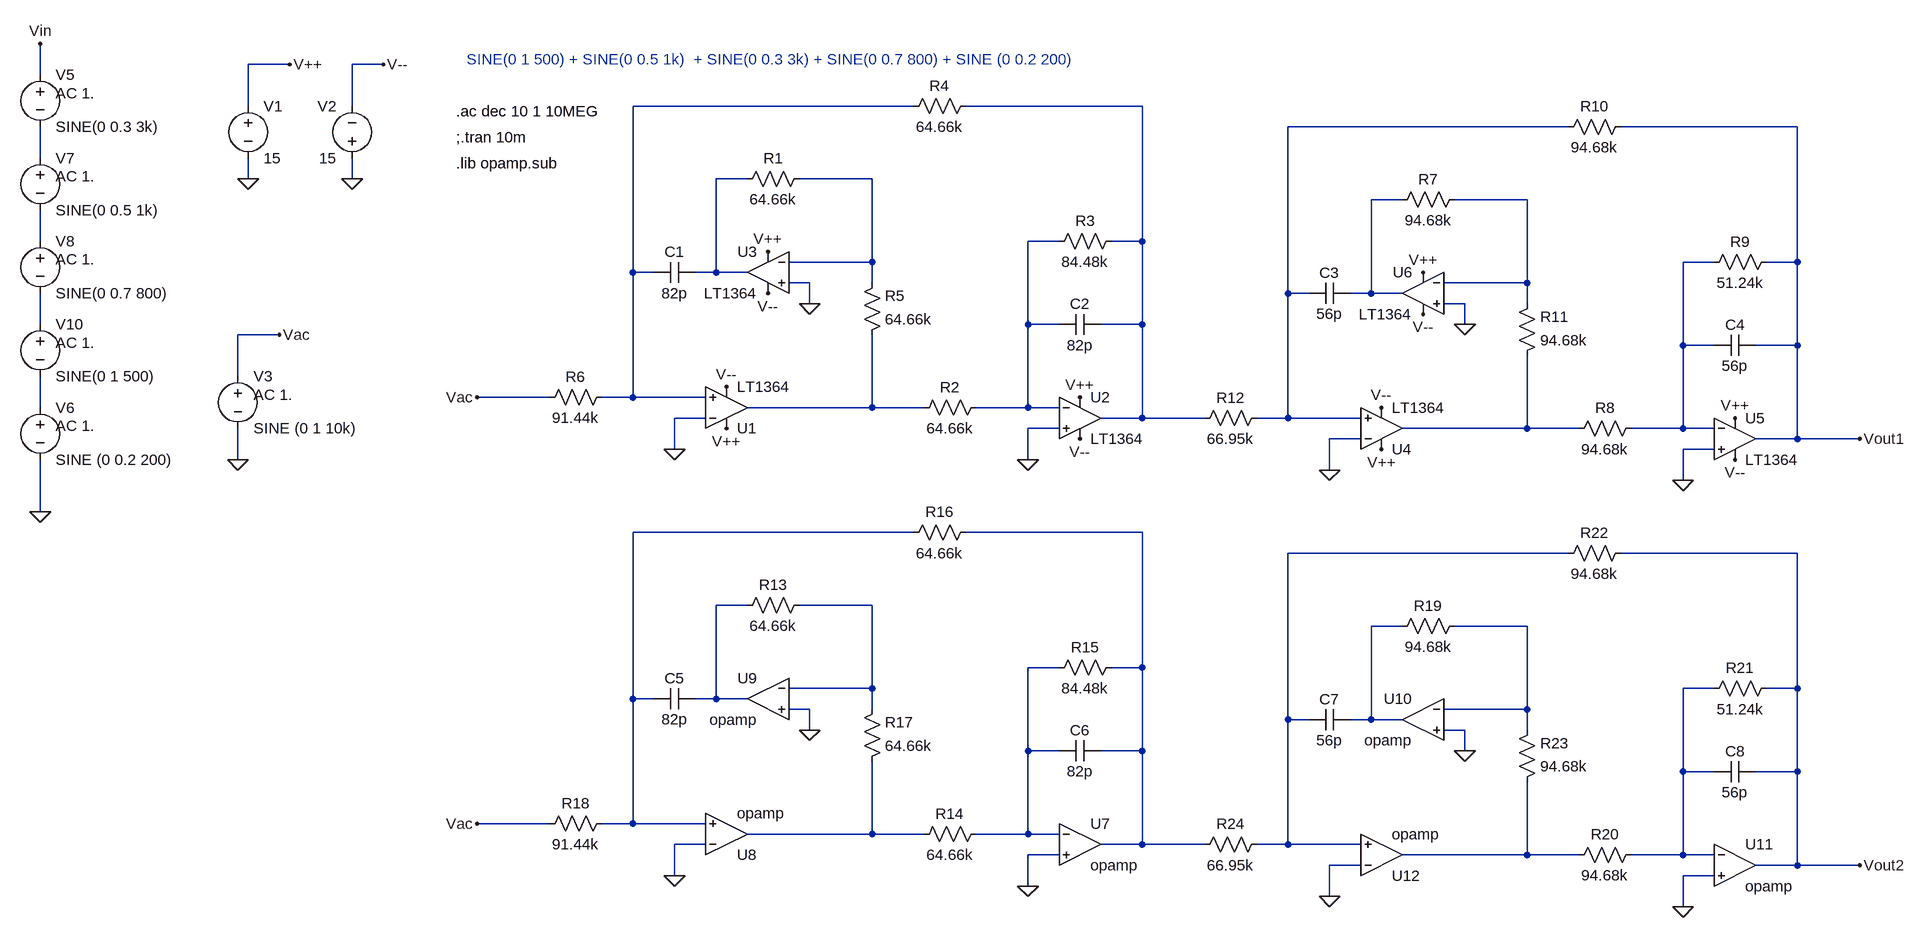
[diagram p0: schematic LT1364_Butterworth_AM.asc]
LT1364_Butterworth_AM.asc, the LTspice schematic file:
Version 4
SHEET 1 2556 680
WIRE -720 -800 -784 -800
WIRE -576 -800 -624 -800
WIRE -1104 -784 -1104 -832
WIRE -784 -736 -784 -800
WIRE -624 -736 -624 -800
WIRE 240 -736 -192 -736
WIRE 592 -736 320 -736
WIRE 1248 -704 816 -704
WIRE 1600 -704 1328 -704
WIRE -1104 -656 -1104 -704
WIRE -784 -624 -784 -656
WIRE -624 -624 -624 -656
WIRE -16 -624 -64 -624
WIRE 176 -624 64 -624
WIRE 992 -592 944 -592
WIRE 1184 -592 1072 -592
WIRE -1104 -528 -1104 -576
WIRE 464 -528 416 -528
WIRE 592 -528 592 -736
WIRE 592 -528 544 -528
WIRE 176 -496 176 -624
WIRE 176 -496 48 -496
WIRE 1472 -496 1424 -496
WIRE 1600 -496 1600 -704
WIRE 1600 -496 1552 -496
WIRE -192 -480 -192 -736
WIRE -160 -480 -192 -480
WIRE -64 -480 -64 -624
WIRE -64 -480 -96 -480
WIRE -16 -480 -64 -480
WIRE 80 -464 48 -464
WIRE 176 -464 176 -496
WIRE 1184 -464 1184 -592
WIRE 1184 -464 1056 -464
WIRE 816 -448 816 -704
WIRE 848 -448 816 -448
WIRE 944 -448 944 -592
WIRE 944 -448 912 -448
WIRE 992 -448 944 -448
WIRE 80 -432 80 -464
WIRE 1088 -432 1056 -432
WIRE 1184 -432 1184 -464
WIRE -1104 -400 -1104 -448
WIRE 416 -400 416 -528
WIRE 464 -400 416 -400
WIRE 592 -400 592 -528
WIRE 592 -400 528 -400
WIRE 1088 -400 1088 -432
WIRE -736 -384 -800 -384
WIRE 1424 -368 1424 -496
WIRE 1472 -368 1424 -368
WIRE 1600 -368 1600 -496
WIRE 1600 -368 1536 -368
WIRE -800 -320 -800 -384
WIRE -320 -288 -432 -288
WIRE -192 -288 -192 -480
WIRE -192 -288 -240 -288
WIRE -80 -288 -192 -288
WIRE -1104 -272 -1104 -320
WIRE 176 -272 176 -384
WIRE 176 -272 -16 -272
WIRE 256 -272 176 -272
WIRE 416 -272 416 -400
WIRE 416 -272 336 -272
WIRE 464 -272 416 -272
WIRE -80 -256 -128 -256
WIRE 592 -256 592 -400
WIRE 592 -256 528 -256
WIRE 688 -256 592 -256
WIRE 816 -256 816 -448
WIRE 816 -256 768 -256
WIRE 928 -256 816 -256
WIRE 464 -240 416 -240
WIRE 1184 -240 1184 -352
WIRE 1184 -240 992 -240
WIRE 1264 -240 1184 -240
WIRE 1424 -240 1424 -368
WIRE 1424 -240 1344 -240
WIRE 1472 -240 1424 -240
WIRE 928 -224 880 -224
WIRE 1600 -224 1600 -368
WIRE 1600 -224 1536 -224
WIRE 1696 -224 1600 -224
WIRE -128 -208 -128 -256
WIRE 1472 -208 1424 -208
WIRE -800 -192 -800 -240
WIRE 416 -192 416 -240
WIRE 880 -176 880 -224
WIRE 1424 -160 1424 -208
WIRE -1104 -112 -1104 -192
WIRE 240 -80 -192 -80
WIRE 592 -80 320 -80
WIRE 1248 -48 816 -48
WIRE 1600 -48 1328 -48
WIRE -16 32 -64 32
WIRE 176 32 64 32
WIRE 992 64 944 64
WIRE 1184 64 1072 64
WIRE 464 128 416 128
WIRE 592 128 592 -80
WIRE 592 128 544 128
WIRE 176 160 176 32
WIRE 176 160 48 160
WIRE 1472 160 1424 160
WIRE 1600 160 1600 -48
WIRE 1600 160 1552 160
WIRE -192 176 -192 -80
WIRE -160 176 -192 176
WIRE -64 176 -64 32
WIRE -64 176 -96 176
WIRE -16 176 -64 176
WIRE 80 192 48 192
WIRE 176 192 176 160
WIRE 1184 192 1184 64
WIRE 1184 192 1056 192
WIRE 816 208 816 -48
WIRE 848 208 816 208
WIRE 944 208 944 64
WIRE 944 208 912 208
WIRE 992 208 944 208
WIRE 80 224 80 192
WIRE 1088 224 1056 224
WIRE 1184 224 1184 192
WIRE 416 256 416 128
WIRE 464 256 416 256
WIRE 592 256 592 128
WIRE 592 256 528 256
WIRE 1088 256 1088 224
WIRE 1424 288 1424 160
WIRE 1472 288 1424 288
WIRE 1600 288 1600 160
WIRE 1600 288 1536 288
WIRE -320 368 -432 368
WIRE -192 368 -192 176
WIRE -192 368 -240 368
WIRE -80 368 -192 368
WIRE 176 384 176 272
WIRE 176 384 -16 384
WIRE 256 384 176 384
WIRE 416 384 416 256
WIRE 416 384 336 384
WIRE 464 384 416 384
WIRE -80 400 -128 400
WIRE 592 400 592 256
WIRE 592 400 528 400
WIRE 688 400 592 400
WIRE 816 400 816 208
WIRE 816 400 768 400
WIRE 928 400 816 400
WIRE 464 416 416 416
WIRE 1184 416 1184 304
WIRE 1184 416 992 416
WIRE 1264 416 1184 416
WIRE 1424 416 1424 288
WIRE 1424 416 1344 416
WIRE 1472 416 1424 416
WIRE 928 432 880 432
WIRE 1600 432 1600 288
WIRE 1600 432 1536 432
WIRE 1696 432 1600 432
WIRE -128 448 -128 400
WIRE 1472 448 1424 448
WIRE 416 464 416 416
WIRE 880 480 880 432
WIRE 1424 496 1424 448
FLAG -784 -624 0
FLAG -624 -624 0
FLAG -720 -800 V++
FLAG -576 -800 V--
FLAG -48 -304 V--
FLAG -48 -240 V++
FLAG -800 -192 0
FLAG 496 -224 V--
FLAG 496 -288 V++
FLAG 16 -448 V--
FLAG 16 -512 V++
FLAG -1104 -832 Vin
FLAG -736 -384 Vac
FLAG -1104 -112 0
FLAG 80 -432 0
FLAG -128 -208 0
FLAG 416 -192 0
FLAG 960 -272 V--
FLAG 960 -208 V++
FLAG 1504 -192 V--
FLAG 1504 -256 V++
FLAG 1024 -416 V--
FLAG 1024 -480 V++
FLAG 1088 -400 0
FLAG 880 -176 0
FLAG 1424 -160 0
FLAG 1696 -224 Vout1
FLAG -432 -288 Vac
FLAG 80 224 0
FLAG -128 448 0
FLAG 416 464 0
FLAG 1088 256 0
FLAG 880 480 0
FLAG 1424 496 0
FLAG 1696 432 Vout2
FLAG -432 368 Vac
SYMBOL Opamps\\LT1364 -48 -208 M180
SYMATTR InstName U1
SYMBOL voltage -784 -752 R0
WINDOW 123 0 0 Left 0
WINDOW 39 0 0 Left 0
SYMATTR InstName V1
SYMATTR Value 15
SYMBOL voltage -624 -640 R180
WINDOW 0 24 96 Left 2
WINDOW 3 24 16 Left 2
SYMATTR InstName V2
SYMATTR Value 15
SYMBOL voltage -800 -336 R0
WINDOW 123 24 44 Left 2
WINDOW 39 0 0 Left 0
SYMATTR Value2 AC 1.
SYMATTR InstName V3
SYMATTR Value SINE (0 1 10k)
SYMBOL Opamps\\LT1364 496 -320 R0
SYMATTR InstName U2
SYMBOL Opamps\\LT1364 16 -544 M0
SYMATTR InstName U3
SYMBOL voltage -1104 -800 R0
WINDOW 123 24 44 Left 2
WINDOW 39 0 0 Left 0
SYMATTR Value2 AC 1.
SYMATTR InstName V5
SYMATTR Value SINE(0 0.3 3k)
SYMBOL voltage -1104 -288 R0
WINDOW 123 24 44 Left 2
WINDOW 39 0 0 Left 0
SYMATTR Value2 AC 1.
SYMATTR InstName V6
SYMATTR Value SINE (0 0.2 200)
SYMBOL voltage -1104 -672 R0
WINDOW 123 24 44 Left 2
WINDOW 39 0 0 Left 0
SYMATTR Value2 AC 1.
SYMATTR InstName V7
SYMATTR Value SINE(0 0.5 1k)
SYMBOL voltage -1104 -544 R0
WINDOW 123 24 44 Left 2
WINDOW 39 0 0 Left 0
SYMATTR Value2 AC 1.
SYMATTR InstName V8
SYMATTR Value SINE(0 0.7 800)
SYMBOL voltage -1104 -416 R0
WINDOW 123 24 44 Left 2
WINDOW 39 0 0 Left 0
SYMATTR Value2 AC 1.
SYMATTR InstName V10
SYMATTR Value SINE(0 1 500)
SYMBOL res 80 -640 R90
WINDOW 0 0 56 VBottom 2
WINDOW 3 32 56 VTop 2
SYMATTR InstName R1
SYMATTR Value 64.66k
SYMBOL res 352 -288 R90
WINDOW 0 0 56 VBottom 2
WINDOW 3 32 56 VTop 2
SYMATTR InstName R2
SYMATTR Value 64.66k
SYMBOL res 560 -544 R90
WINDOW 0 0 56 VBottom 2
WINDOW 3 32 56 VTop 2
SYMATTR InstName R3
SYMATTR Value 84.48k
SYMBOL res 336 -752 R90
WINDOW 0 0 56 VBottom 2
WINDOW 3 32 56 VTop 2
SYMATTR InstName R4
SYMATTR Value 64.66k
SYMBOL res 160 -368 M180
WINDOW 0 36 76 Left 2
WINDOW 3 36 40 Left 2
SYMATTR InstName R5
SYMATTR Value 64.66k
SYMBOL res -224 -304 R90
WINDOW 0 0 56 VBottom 2
WINDOW 3 32 56 VTop 2
SYMATTR InstName R6
SYMATTR Value 91.44k
SYMBOL cap -96 -496 R90
WINDOW 0 0 32 VBottom 2
WINDOW 3 32 32 VTop 2
SYMATTR InstName C1
SYMATTR Value 82p
SYMBOL cap 528 -416 R90
WINDOW 0 0 32 VBottom 2
WINDOW 3 32 32 VTop 2
SYMATTR InstName C2
SYMATTR Value 82p
SYMBOL Opamps\\LT1364 960 -176 M180
SYMATTR InstName U4
SYMBOL Opamps\\LT1364 1504 -288 R0
SYMATTR InstName U5
SYMBOL Opamps\\LT1364 1024 -512 M0
SYMATTR InstName U6
SYMBOL res 1088 -608 R90
WINDOW 0 0 56 VBottom 2
WINDOW 3 32 56 VTop 2
SYMATTR InstName R7
SYMATTR Value 94.68k
SYMBOL res 1360 -256 R90
WINDOW 0 0 56 VBottom 2
WINDOW 3 32 56 VTop 2
SYMATTR InstName R8
SYMATTR Value 94.68k
SYMBOL res 1568 -512 R90
WINDOW 0 0 56 VBottom 2
WINDOW 3 32 56 VTop 2
SYMATTR InstName R9
SYMATTR Value 51.24k
SYMBOL res 1344 -720 R90
WINDOW 0 0 56 VBottom 2
WINDOW 3 32 56 VTop 2
SYMATTR InstName R10
SYMATTR Value 94.68k
SYMBOL res 1168 -336 M180
WINDOW 0 36 76 Left 2
WINDOW 3 36 40 Left 2
SYMATTR InstName R11
SYMATTR Value 94.68k
SYMBOL res 784 -272 R90
WINDOW 0 0 56 VBottom 2
WINDOW 3 32 56 VTop 2
SYMATTR InstName R12
SYMATTR Value 66.95k
SYMBOL cap 912 -464 R90
WINDOW 0 0 32 VBottom 2
WINDOW 3 32 32 VTop 2
SYMATTR InstName C3
SYMATTR Value 56p
SYMBOL cap 1536 -384 R90
WINDOW 0 0 32 VBottom 2
WINDOW 3 32 32 VTop 2
SYMATTR InstName C4
SYMATTR Value 56p
SYMBOL res 80 16 R90
WINDOW 0 0 56 VBottom 2
WINDOW 3 32 56 VTop 2
SYMATTR InstName R13
SYMATTR Value 64.66k
SYMBOL res 352 368 R90
WINDOW 0 0 56 VBottom 2
WINDOW 3 32 56 VTop 2
SYMATTR InstName R14
SYMATTR Value 64.66k
SYMBOL res 560 112 R90
WINDOW 0 0 56 VBottom 2
WINDOW 3 32 56 VTop 2
SYMATTR InstName R15
SYMATTR Value 84.48k
SYMBOL res 336 -96 R90
WINDOW 0 0 56 VBottom 2
WINDOW 3 32 56 VTop 2
SYMATTR InstName R16
SYMATTR Value 64.66k
SYMBOL res 160 288 M180
WINDOW 0 36 76 Left 2
WINDOW 3 36 40 Left 2
SYMATTR InstName R17
SYMATTR Value 64.66k
SYMBOL res -224 352 R90
WINDOW 0 0 56 VBottom 2
WINDOW 3 32 56 VTop 2
SYMATTR InstName R18
SYMATTR Value 91.44k
SYMBOL cap -96 160 R90
WINDOW 0 0 32 VBottom 2
WINDOW 3 32 32 VTop 2
SYMATTR InstName C5
SYMATTR Value 82p
SYMBOL cap 528 240 R90
WINDOW 0 0 32 VBottom 2
WINDOW 3 32 32 VTop 2
SYMATTR InstName C6
SYMATTR Value 82p
SYMBOL res 1088 48 R90
WINDOW 0 0 56 VBottom 2
WINDOW 3 32 56 VTop 2
SYMATTR InstName R19
SYMATTR Value 94.68k
SYMBOL res 1360 400 R90
WINDOW 0 0 56 VBottom 2
WINDOW 3 32 56 VTop 2
SYMATTR InstName R20
SYMATTR Value 94.68k
SYMBOL res 1568 144 R90
WINDOW 0 0 56 VBottom 2
WINDOW 3 32 56 VTop 2
SYMATTR InstName R21
SYMATTR Value 51.24k
SYMBOL res 1344 -64 R90
WINDOW 0 0 56 VBottom 2
WINDOW 3 32 56 VTop 2
SYMATTR InstName R22
SYMATTR Value 94.68k
SYMBOL res 1168 320 M180
WINDOW 0 36 76 Left 2
WINDOW 3 36 40 Left 2
SYMATTR InstName R23
SYMATTR Value 94.68k
SYMBOL res 784 384 R90
WINDOW 0 0 56 VBottom 2
WINDOW 3 32 56 VTop 2
SYMATTR InstName R24
SYMATTR Value 66.95k
SYMBOL cap 912 192 R90
WINDOW 0 0 32 VBottom 2
WINDOW 3 32 32 VTop 2
SYMATTR InstName C7
SYMATTR Value 56p
SYMBOL cap 1536 272 R90
WINDOW 0 0 32 VBottom 2
WINDOW 3 32 32 VTop 2
SYMATTR InstName C8
SYMATTR Value 56p
SYMBOL Opamps\\opamp 496 336 R0
SYMATTR InstName U7
SYMATTR SpiceLine2 GBW=70Meg
SYMBOL Opamps\\opamp -48 448 M180
SYMATTR InstName U8
SYMATTR SpiceLine2 GBW=70Meg
SYMBOL Opamps\\opamp 16 112 M0
SYMATTR InstName U9
SYMATTR SpiceLine2 GBW=70Meg
SYMBOL Opamps\\opamp 1024 144 M0
SYMATTR InstName U10
SYMATTR SpiceLine2 GBW=70Meg
SYMBOL Opamps\\opamp 1504 368 R0
SYMATTR InstName U11
SYMATTR SpiceLine2 GBW=70Meg
SYMBOL Opamps\\opamp 960 480 M180
SYMATTR InstName U12
SYMATTR SpiceLine2 GBW=70Meg
TEXT -464 -728 Left 2 !.ac dec 10 1 10MEG
TEXT -464 -688 Left 2 !;.tran 10m
TEXT -448 -808 Left 2 ;SINE(0 1 500) + SINE(0 0.5 1k)  + SINE(0 0.3 3k) + SINE(0 0.7 800) + SINE (0 0.2 200)
TEXT -464 -648 Left 2 !.lib opamp.sub

The netlist it stands for:
* LT1364_Butterworth_AM.asc
XU1 N001 0 V++ V-- N014 LT1363  ; LT1364, pins In+ In- V+ V- OUT
V1 V++ 0 15
V2 0 V-- 15
V3 Vac 0 SINE (0 1 10k) AC 1.
XU2 0 N010 V++ V-- N002 LT1363  ; LT1364, pins In+ In- V+ V- OUT
XU3 0 N006 V++ V-- N005 LT1363  ; LT1364, pins In+ In- V+ V- OUT
V5 Vin N004 SINE(0 0.3 3k) AC 1.
V6 N013 0 SINE (0 0.2 200) AC 1.
V7 N004 N009 SINE(0 0.5 1k) AC 1.
V8 N009 N012 SINE(0 0.7 800) AC 1.
V10 N012 N013 SINE(0 1 500) AC 1.
R1 N006 N005 64.66k
R2 N010 N014 64.66k
R3 N002 N010 84.48k
R4 N002 N001 64.66k
R5 N014 N006 64.66k
R6 N001 Vac 91.44k
C1 N005 N001 82p
C2 N002 N010 82p
XU4 N003 0 V++ V-- N015 LT1363  ; LT1364, pins In+ In- V+ V- OUT
XU5 0 N011 V++ V-- Vout1 LT1363  ; LT1364, pins In+ In- V+ V- OUT
XU6 0 N008 V++ V-- N007 LT1363  ; LT1364, pins In+ In- V+ V- OUT
R7 N008 N007 94.68k
R8 N011 N015 94.68k
R9 Vout1 N011 51.24k
R10 Vout1 N003 94.68k
R11 N015 N008 94.68k
R12 N003 N002 66.95k
C3 N007 N003 56p
C4 Vout1 N011 56p
R13 N020 N019 64.66k
R14 N023 N025 64.66k
R15 N017 N023 84.48k
R16 N017 N016 64.66k
R17 N025 N020 64.66k
R18 N016 Vac 91.44k
C5 N019 N016 82p
C6 N017 N023 82p
R19 N022 N021 94.68k
R20 N024 N026 94.68k
R21 Vout2 N024 51.24k
R22 Vout2 N018 94.68k
R23 N026 N022 94.68k
R24 N018 N017 66.95k
C7 N021 N018 56p
C8 Vout2 N024 56p
XU7 N023 0 N017 opamp Aol=100K GBW=70Meg  ; pins invin noninvin out
XU8 0 N016 N025 opamp Aol=100K GBW=70Meg  ; pins invin noninvin out
XU9 N020 0 N019 opamp Aol=100K GBW=70Meg  ; pins invin noninvin out
XU10 N022 0 N021 opamp Aol=100K GBW=70Meg  ; pins invin noninvin out
XU11 N024 0 Vout2 opamp Aol=100K GBW=70Meg  ; pins invin noninvin out
XU12 0 N018 N026 opamp Aol=100K GBW=70Meg  ; pins invin noninvin out
.ac dec 10 1 10MEG
;.tran 10m
* SINE(0 1 500) + SINE(0 0.5 1k)  + SINE(0 0.3 3k) + SINE(0 0.7 800) + SINE (0 0.2 200)
.lib opamp.sub
.lib LTC.lib
.backanno
.end